# Altium schematic sheet ansari.SCHDOC
size B
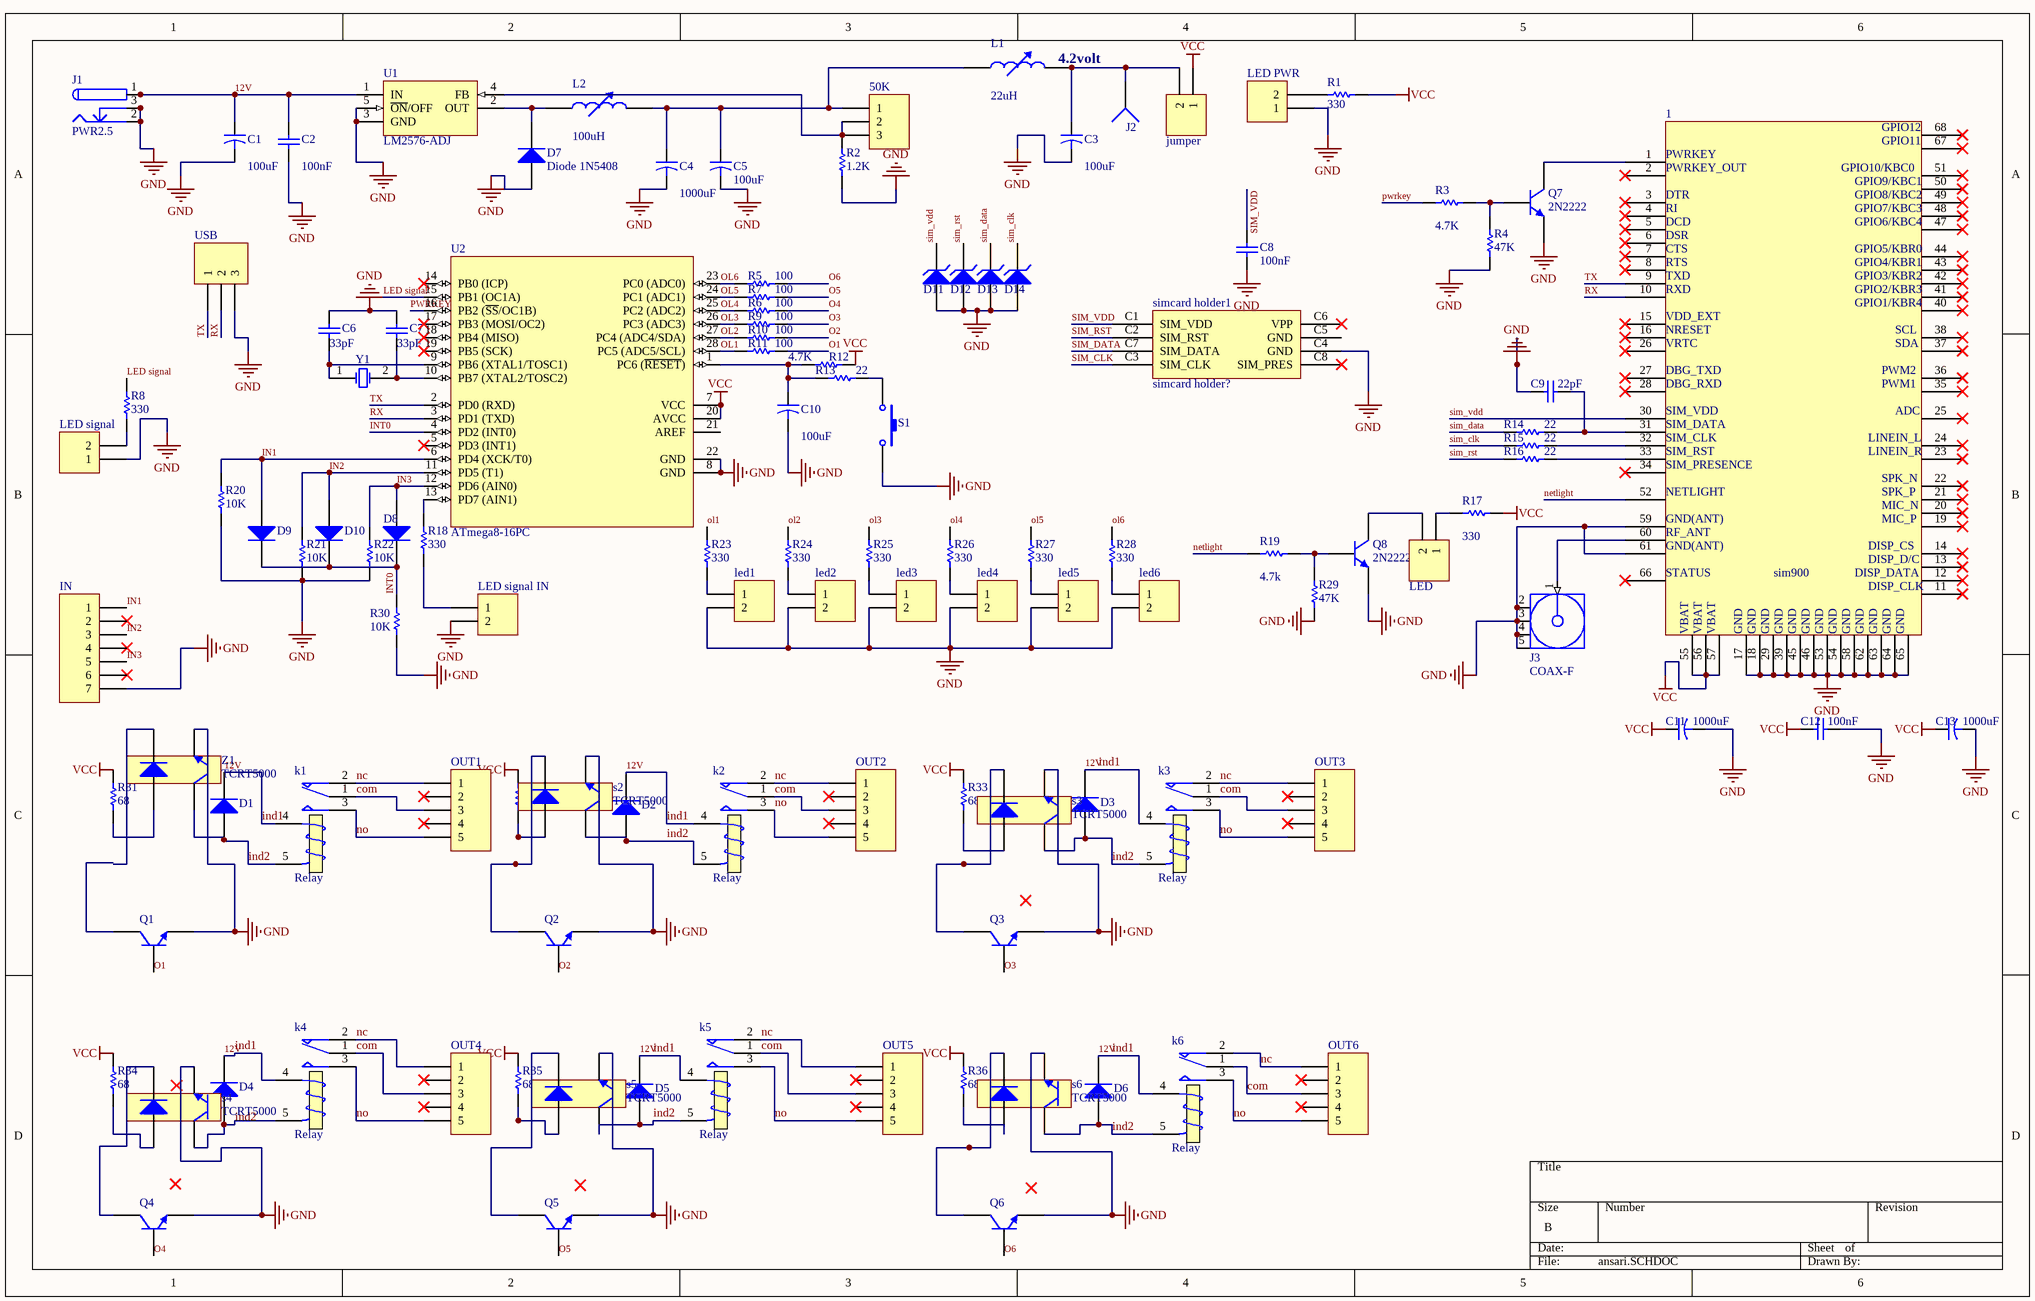
[diagram p0: ansari.SCHDOC]

## Parts
1  sim900  [SIM900]
50K  Header 3  [HDR1X3]  (value not drawn)
C1  value 100uF  [CAPR5-4X5]  (hidden comment: Cap2)
C2  value 100nF  [VP32-3.2]  (hidden comment: Cap)
C3  value 100uF  [CAPR5-4X5]  (hidden comment: Cap2)
C4  value 1000uF  [CAPR5-4X5]  (hidden comment: Cap2)
C5  value 100uF  [CAPR5-4X5]  (hidden comment: Cap2)
C6  value 33pF  [VP32-3.2]  (hidden comment: Cap)
C7  value 33pF  [VP32-3.2]  (hidden comment: Cap)
C8  value 100nF  [VP32-3.2]  (hidden comment: Cap)
C9  value 22pF  [VP32-3.2]  (hidden comment: Cap)
C10  value 100uF  [CAPR5-4X5]  (hidden comment: Cap2)
C11  value 1000uF  [CAPR5-4X5]  (hidden comment: Cap2)
C12  value 100nF  [RAD-0.3]  (hidden comment: Cap)
C13  value 1000uF  [CAPR5-4X5]  (hidden comment: Cap2)
D1  Diode 1N4148  [DO-35]  (value not drawn)
D2  Diode 1N4148  [DO-35]  (value not drawn)
D3  Diode 1N4148  [DO-35]  (value not drawn)
D4  Diode 1N4148  [DO-35]  (value not drawn)
D5  Diode 1N4148  [DO-35]  (value not drawn)
D6  Diode 1N4148  [DO-35]  (value not drawn)
D7  Diode 1N5408  [DO-201AD]
D8  Diode 1N4148  [DO-35]  (value not drawn)
D9  Diode 1N4148  [DO-35]  (value not drawn)
D10  Diode 1N4148  [DO-35]  (value not drawn)
D11  D Zener4v7  [DIODE-0.7]  (value not drawn)
D12  D Zener4v7  [DIODE-0.7]  (value not drawn)
D13  D Zener4v7  [DIODE-0.7]  (value not drawn)
D14  D Zener4v7  [DIODE-0.7]  (value not drawn)
IN  Header 7  [HDR1X7]  (value not drawn)
J1  PWR2.5  [KLD-0202]
J2  Socket  [PIN1]  (value not drawn)
J3  COAX-F  [MCX5.08-H5]
jumper  Header 2  [HDR1X2]  (value not drawn)
k1  Relay  [Relays]
k2  Relay  [Relays]
k3  Relay  [Relays]
k4  Relay  [Relays]
k5  Relay  [Relays]
k6  Relay  [Relays]
L1  value 22uH  [AXIAL-0.8]  (hidden comment: Inductor Adj)
L2  value 100uH  [AXIAL-0.8]  (hidden comment: Inductor Adj)
LED  Header 2  [HDR1X2]  (value not drawn)
led1  Header 2  [HDR1X2]  (value not drawn)
led2  Header 2  [HDR1X2]  (value not drawn)
led3  Header 2  [HDR1X2]  (value not drawn)
led4  Header 2  [HDR1X2]  (value not drawn)
led5  Header 2  [HDR1X2]  (value not drawn)
led6  Header 2  [HDR1X2]  (value not drawn)
LED_PWR  Header 2  [HDR1X2]  (value not drawn)
LED_signal  Header 2  [HDR1X2]  (value not drawn)
LED_signal_IN  Header 2  [HDR1X2]  (value not drawn)
OUT1  Header 5  [HDR1X5]  (value not drawn)
OUT2  Header 5  [HDR1X5]  (value not drawn)
OUT3  Header 5  [HDR1X5]  (value not drawn)
OUT4  Header 5  [HDR1X5]  (value not drawn)
OUT5  Header 5  [HDR1X5]  (value not drawn)
OUT6  Header 5  [HDR1X5]  (value not drawn)
Q1  2N2222  [22-03]  (value not drawn)
Q2  2N2222  [22-03]  (value not drawn)
Q3  2N2222  [22-03]  (value not drawn)
Q4  2N2222  [22-03]  (value not drawn)
Q5  2N2222  [22-03]  (value not drawn)
Q6  2N2222  [22-03]  (value not drawn)
Q7  2N2222  [22-03]
Q8  2N2222  [22-03]
R1  value 330  [AXIAL-0.3]  (hidden comment: Res1)
R2  value 1.2K  [AXIAL-0.3]  (hidden comment: Res1)
R3  value 4.7K  [AXIAL-0.3]  (hidden comment: Res1)
R4  value 47K  [AXIAL-0.3]  (hidden comment: Res1)
R5  value 100  [AXIAL-0.3]  (hidden comment: Res1)
R6  value 100  [AXIAL-0.3]  (hidden comment: Res1)
R7  value 100  [AXIAL-0.3]  (hidden comment: Res1)
R8  value 330  [AXIAL-0.3]  (hidden comment: Res1)
R9  value 100  [AXIAL-0.3]  (hidden comment: Res1)
R10  value 100  [AXIAL-0.3]  (hidden comment: Res1)
R11  value 100  [AXIAL-0.3]  (hidden comment: Res1)
R12  value 4.7K  [AXIAL-0.3]  (hidden comment: Res1)
R13  value 22  [AXIAL-0.3]  (hidden comment: Res1)
R14  value 22  [AXIAL-0.3]  (hidden comment: Res1)
R15  value 22  [AXIAL-0.3]  (hidden comment: Res1)
R16  value 22  [AXIAL-0.3]  (hidden comment: Res1)
R17  value 330  [AXIAL-0.3]  (hidden comment: Res1)
R18  value 330  [AXIAL-0.3]  (hidden comment: Res1)
R19  value 4.7k  [AXIAL-0.3]  (hidden comment: Res1)
R20  value 10K  [AXIAL-0.3]  (hidden comment: Res1)
R21  value 10K  [AXIAL-0.3]  (hidden comment: Res1)
R22  value 10K  [AXIAL-0.3]  (hidden comment: Res1)
R23  value 330  [AXIAL-0.3]  (hidden comment: Res1)
R24  value 330  [AXIAL-0.3]  (hidden comment: Res1)
R25  value 330  [AXIAL-0.3]  (hidden comment: Res1)
R26  value 330  [AXIAL-0.3]  (hidden comment: Res1)
R27  value 330  [AXIAL-0.3]  (hidden comment: Res1)
R28  value 330  [AXIAL-0.3]  (hidden comment: Res1)
R29  value 47K  [AXIAL-0.3]  (hidden comment: Res1)
R30  value 10K  [AXIAL-0.3]  (hidden comment: Res1)
R31  value 68  [AXIAL-0.3]  (hidden comment: Res1)
R32  value 68  [AXIAL-0.3]  (hidden comment: Res1)
R33  value 68  [AXIAL-0.3]  (hidden comment: Res1)
R34  value 68  [AXIAL-0.3]  (hidden comment: Res1)
R35  value 68  [AXIAL-0.3]  (hidden comment: Res1)
R36  value 68  [AXIAL-0.3]  (hidden comment: Res1)
S1  SW-PB  [SPST-2]  (value not drawn)
s2  TCRT5000  [TCRT5000]
s3  TCRT5000  [TCRT5000]
s4  TCRT5000  [TCRT5000]
s5  TCRT5000  [TCRT5000]
s6  TCRT5000  [TCRT5000]
simcard_holder1  simcard holder?  [Sim Card]
U1  LM2576-ADJ  [T05A]
U2  ATmega8-16PC  [28P3]
USB  Header 3  [HDR1X3]  (value not drawn)
Y1  XTAL  [R38]  (value not drawn)
Z1  TCRT5000  [TCRT5000]

## Nets
GND: 1.17 1.18 1.29 1.39 1.45 1.46 1.53 1.54 1.58 1.59 1.61 1.62 1.63 1.64 1.65 C1.2 C2.1 C3.2 C4.2 C5.2 C6.2 C7.2 C8.2 C9.2 C10.2 C11.2 C12.2 C13.2 D7.1(A) D11.1(A) D12.1(A) D13.1(A) D14.1(A) IN.7 J1.2 J1.2A J1.2B J1.3 J1.3A J1.3B J3.2(GND) J3.3(GND) J3.4(GND) J3.5(GND) led1.2 led2.2 led3.2 led4.2 led5.2 led6.2 LED_PWR.1 LED_signal.1 LED_signal_IN.2 Q1.1(E) Q2.1(E) Q3.1(E) Q4.1(E) Q5.1(E) Q6.1(E) Q7.1(E) Q8.1(E) R2.1 R4.1 R20.1 R21.1 R22.1 R29.1 R30.1 S1.2 s2.E s3.E s4.E s5.E s6.E simcard_holder1.C4(GND) U1.3(GND) U1.5(~{ON}/OFF) U2.8(GND) U2.22(GND) USB.3 Z1.E
VCC: 1.55 1.56 1.57 C11.1 C12.1 C13.1 jumper.1 R1.1 R12.2 R17.2 R31.2 R32.2 R33.2 R34.2 R35.2 R36.2 U2.7(VCC) U2.20(AVCC)
12V: C1.1 C2.2 D1.2(K) D2.2(K) D3.2(K) D4.2(K) D5.2(K) D6.2(K) J1.1 J1.1A J1.1B k1.4(T1) k2.4(T1) k3.4(T1) k4.4(T1) k5.4(T1) k6.4(T1) U1.1(IN)  [also labelled ind1]
com: k1.1(COM) k2.1(COM) k3.1(COM) k4.1(COM) k5.1(COM) k6.1(COM) OUT1.3 OUT2.3 OUT3.3 OUT4.3 OUT5.3 OUT6.3
IN1: D9.1(A) IN.1 R20.2 U2.6(PD4_(XCK/T0))
IN2: D10.1(A) IN.3 R21.2 U2.11(PD5_(T1))
IN3: D8.1(A) IN.5 R22.2 U2.12(PD6_(AIN0))
ind2: D1.1(A) D2.1(A) D3.1(A) D4.1(A) D5.1(A) D6.1(A) k1.5(T2) k2.5(T2) k3.5(T2) k4.5(T2) k5.5(T2) k6.5(T2) s2.C s3.C s4.C s5.C s6.C Z1.C
INT0: D8.2(K) D9.2(K) D10.2(K) R30.2 U2.4(PD2_(INT0))
LED signal: R8.2 U2.15(PB1_(OC1A))
nc: k1.2(NC) k2.2(NC) k3.2(NC) k4.2(NC) k5.2(NC) k6.2(NC) OUT1.1 OUT2.1 OUT3.1 OUT4.1 OUT5.1 OUT6.1
netlight: 1.52 R19.1
no: k1.3(NO) k2.3(NO) k3.3(NO) k4.3(NO) k5.3(NO) k6.3(NO) OUT1.5 OUT2.5 OUT3.5 OUT4.5 OUT5.5 OUT6.5
O1: Q1.2(B) R11.2
O2: Q2.2(B) R10.2
O3: Q3.2(B) R9.2
O4: Q4.2(B) R6.2
O5: Q5.2(B) R7.2
O6: Q6.2(B) R5.2
OL1: R11.1 R23.2 U2.28(PC5_(ADC5/SCL))
OL2: R10.1 R24.2 U2.27(PC4_(ADC4/SDA))
OL3: R9.1 R25.2 U2.26(PC3_(ADC3))
OL4: R6.1 R26.2 U2.25(PC2_(ADC2))
OL5: R7.1 R27.2 U2.24(PC1_(ADC1))
OL6: R5.1 R28.2 U2.23(PC0_(ADC0))
PWRKEY: R3.1 U2.16(PB2_(~{SS}/OC1B))
RX: 1.10 U2.3(PD1_(TXD)) USB.2
sim_clk: D14.2(K) R15.1 simcard_holder1.C3(SIM_CLK)
sim_data: D13.2(K) R14.1 simcard_holder1.C7(SIM_DATA)
sim_rst: D12.2(K) R16.1 simcard_holder1.C2(SIM_RST)
sim_vdd: 1.30 C8.1 D11.2(K) simcard_holder1.C1(SIM_VDD)
TX: 1.9 U2.2(PD0_(RXD)) USB.1
Net1_1: 1.1 Q7.3(C)
Net1_31: 1.31 C9.1 R14.2
Net1_32: 1.32 R15.2
Net1_33: 1.33 R16.2
Net1_60: 1.60 J3.1(Signal)
Net50K_1: 50K.1 C4.1 C5.1 L1.1 L2.2
Net50K_2: 50K.2 50K.3 R2.2 U1.4(FB)
NetC3_1: C3.1 J2.1 jumper.2 L1.2
NetC6_1: C6.1 U2.9(PB6_(XTAL1/TOSC1)) Y1.1(OSC1)
NetC7_1: C7.1 U2.10(PB7_(XTAL2/TOSC2)) Y1.2(OSC2)
NetC10_1: C10.1 R12.1 R13.1 U2.1(PC6_(~{RESET}))
NetD7_2: D7.2(K) L2.1 U1.2(OUT)
Netled1_1: led1.1 R23.1
Netled2_1: led2.1 R24.1
Netled3_1: led3.1 R25.1
Netled4_1: led4.1 R26.1
Netled5_1: led5.1 R27.1
Netled6_1: led6.1 R28.1
NetLED_1: LED.1 R17.1
NetLED_2: LED.2 Q8.3(C)
NetLED_PWR_2: LED_PWR.2 R1.2
NetLED_signal_2: LED_signal.2 R8.1
NetLED_signal_IN_1: LED_signal_IN.1 R18.1
NetQ2_3: Q2.3(C) s2.K
NetQ3_3: Q3.3(C) s3.K
NetQ4_3: Q4.3(C) s4.K
NetQ5_3: Q5.3(C) s5.K
NetQ6_3: Q6.3(C) s6.K
NetQ7_2: Q7.2(B) R3.2 R4.2
NetQ8_2: Q8.2(B) R19.2 R29.2
NetR13_2: R13.2 S1.1
NetR18_2: R18.2 U2.13(PD7_(AIN1))
NetR31_1: R31.1 Z1.A
NetR32_1: R32.1 s2.A
NetR33_1: R33.1 s3.A
NetR34_1: R34.1 s4.A
NetR35_1: R35.1 s5.A
NetR36_1: R36.1 s6.A

Not connected (* = marked no-connect by the designer): 1 2* 3* 4* 5* 6* 7* 8* 11* 12* 13* 14* 15* 16* 19* 20* 21* 22* 23* 24* 25* 26* 27* 28* 34* 35* 36* 37* 38* 40* 41* 42* 43* 44* 47* 48* 49* 50* 51* 66* 67* 68*; IN 2* 4* 6*; OUT1 2* 4*; OUT2 2* 4*; OUT3 2* 4*; OUT4 2* 4*; OUT5 2* 4*; OUT6 2* 4*; Q1 3(C); simcard_holder1 C5(GND) C6(VPP)* C8(SIM_PRES)*; U2 5(PD3_(INT1))* 14(PB0_(ICP))* 17(PB3_(MOSI/OC2))* 18(PB4_(MISO))* 19(PB5_(SCK))* 21(AREF); Z1 K

## Notes on the sheet
- (near L1) 4.2volt
- (in symbol sim900) GPIO12; GPIO11; PWRKEY; PWRKEY_OUT; GPIO10/KBC0; GPIO9/KBC1; DTR; GPIO8/KBC2; RI; GPIO7/KBC3; DCD; GPIO6/KBC4; DSR; CTS; GPIO5/KBR0; RTS; GPIO4/KBR1; TXD; GPIO3/KBR2; RXD; GPIO2/KBR3; GPIO1/KBR4; VDD_EXT; NRESET; SCL; VRTC; SDA; DBG_TXD; PWM2; DBG_RXD; PWM1; SIM_VDD; ADC; SIM_DATA; SIM_CLK; LINEIN_L; SIM_RST; LINEIN_R; SIM_PRESENCE; SPK_N; NETLIGHT; SPK_P; MIC_N; GND(ANT); MIC_P; RF_ANT; DISP_CS; DISP_D/C; STATUS; DISP_DATA; DISP_CLK; VBAT; GND

## Library data of the parts
50K USB = Header 3: Header, 3-Pin; LatestRevisionDate: 17-Jul-2002; LatestRevisionNote: Re-released for DXP Platform.; Publisher: Altium Limited
C1 C3-C5 C10 C11 C13 = Cap2: Capacitor; Published: 23-Sep-2002; PackageReference: CAPR5-4X5; Publisher: Altium Limited
C2 C6-C9 C12 = Cap: Capacitor; Published: 8-Jun-2000; LatestRevisionDate: 17-Jul-2002; LatestRevisionNote: Re-released for DXP Platform.; PackageReference: RAD-0.3; Publisher: Altium Limited
D1-D6 D8-D10 = Diode 1N4148: High Conductance Fast Diode; Published: 8-Jun-2000; LatestRevisionDate: 17-Jul-2002; LatestRevisionNote: Re-released for DXP Platform.; DatasheetDocument: 1997; PackageReference: DO-35; Publisher: Altium Limited; Code_JEDEC: DO-204-AH; ComponentLink1Description: Manufacturer Link; ComponentLink1URL: http://www.fairchildsemi.com/; ComponentLink2Description: Datasheet; ComponentLink2URL: http://www.fairchildsemi.com/ds/1N%2F1N4148.pdf
D7 = Diode 1N5408: 3 Amp Medium Power Silicon Rectifier Diode; Published: 8-Jun-2000; LatestRevisionDate: 17-Jul-2002; LatestRevisionNote: Re-released for DXP Platform.; DatasheetDocument: Aug-1984; PackageReference: DO-201AD; Publisher: Altium Limited; ComponentLink1Description: Manufacturer Link; ComponentLink1URL: http://www.irf.com/
D11-D14 = D Zener: Zener Diode; Published: 8-Jun-2000; LatestRevisionDate: 17-Jul-2002; LatestRevisionNote: Re-released for DXP Platform.; PackageReference: DIODE-0.7; Publisher: Altium Limited
IN = Header 7: Header, 7-Pin; LatestRevisionDate: 17-Jul-2002; LatestRevisionNote: Re-released for DXP Platform.; Publisher: Altium Limited
J1 = PWR2.5: Low Voltage Power Supply Connector; Published: 17-Dec-2003; DatasheetDocument: 09-May-2002; Publisher: Altium Limited; ComponentLink1Description: Manufacturer Link; ComponentLink1URL: http://domino.kycon.com/internet/Products.html
J3 = COAX-F: RF Coaxial PCB Connector, MCX; Thru-Hole, Right-Angle Mount Socket, Blunt Post Terminal, 50 Ohm Impedance; PCB_Layout: Complies with manufacturer's recommendation.; DrillSize: Corresponds to nominal value.; Published: 15-Jul-2004; LatestRevisionDate: 15-Jul-2004; LatestRevisionNote: Component Replaced.; DatasheetDocument: 30-May-2003; PackageDocument: 04-Jul-1999; PackageReference: 919-119J-51AX; Publisher: Altium Limited; ComponentLink1Description: Manufacturer Link; ComponentLink1URL: http://www.amphenolrf.com/
jumper LED led1-led6 LED_PWR LED_signal LED_signal_IN = Header 2: Header, 2-Pin; LatestRevisionDate: 17-Jul-2002; LatestRevisionNote: Re-released for DXP Platform.; Publisher: Altium Limited
k1-k6 = Relay: SPDT Relay; Published: 8-Jun-2000; LatestRevisionDate: 17-Jul-2002; LatestRevisionNote: Re-released for DXP Platform.; PackageReference: MODULE5B; Publisher: Altium Limited
L1 L2 = Inductor Adj: Adjustable Inductor; Set Position: 0.5; Published: 24-Mar-1999; LatestRevisionDate: 17-Jul-2002; LatestRevisionNote: Re-released for DXP Platform.; PackageReference: AXIAL-0.8; Publisher: Altium Limited
OUT1-OUT6 = Header 5: Header, 5-Pin; LatestRevisionDate: 17-Jul-2002; LatestRevisionNote: Re-released for DXP Platform.; Publisher: Altium Limited
Q1-Q8 = 2N2222: General Purpose Transistor NPN Silicon; Published: 29-Sep-2000; LatestRevisionDate: 17-Jul-2002; LatestRevisionNote: Re-released for DXP Platform.; DatasheetVersion: 1991; PackageVersion: 1997; PackageReference: 22-03; Publisher: Altium Limited; PackageDescription: Can; 3 Leads; Pin Circle Dia. 2.54 mm; Lead Dia. 0.48 mm (max); ComponentLink1Description: Manufacturer Link; ComponentLink1URL: http://www.onsemi.com/site/products/landing?taxonomyID=194
R1-R36 = Res1: Resistor; Published: 8-Jun-2000; LatestRevisionDate: 17-Jul-2002; LatestRevisionNote: Re-released for DXP Platform.; PackageReference: AXIAL-0.3; Publisher: Altium Limited
S1 = SW-PB: Switch; Published: 24-Mar-1999; LatestRevisionDate: 17-Jul-2002; LatestRevisionNote: Re-released for DXP Platform.; PackageReference: SPST-2; Publisher: Altium Limited
s2-s6 Z1 = TCRT5000: IR LED; T&R; Designer: Seyed Mohsen Ghasemain; ComponentLinkURL: www.picpars.com
simcard_holder1 = simcard holder
U1 = LM2576HVT-5.0: Simple Switcher 3A Step Down Voltage Regulator; Note: Tab is connected to GND; Published: 15-Apr-2002; DatasheetVersion: Jun-1999; PackageVersion: 2000; PackageReference: T05A; Publisher: Altium Limited; PackageDescription: TO, Thru-Hole, Vertical, Heatsink Mounted; 5 In-Line Leads; Pitch 1.70 mm; Code_JEDEC: TS-001-AA; ComponentLink1Description: Manufacturer Link; ComponentLink1URL: http://www.national.com/; ComponentLink2Description: Datasheet; ComponentLink2URL: http://www.national.com/ds.cgi/LM/LM2576.pdf; ComponentLink3Description: URL Link1; ComponentLink3URL: http://www.national.com/pf/LM/LM2576HV.html
U2 = ATmega8-16PC: 8-Bit AVR Microcontroller with 8K Bytes of In-System Programmable Flash Memory; Published: 17-Sep-2003; LatestRevisionDate: 04-Mar-2005; LatestRevisionNote: Stylized 3D Model Added.; DatasheetVersion: 2486H-AVR-09/02; PackageVersion: revB, Sep-2001; PackageReference: 28P3; Publisher: Altium Limited; PackageDescription: DIP; 28 Leads; Row Spacing 7.62 mm; Pitch 2.54 mm; ComponentLink1Description: Manufacturer Link; ComponentLink1URL: http://www.atmel.com; ComponentLink2Description: Datasheet; ComponentLink2URL: http://www.atmel.com/dyn/resources/prod_documents/doc2486.pdf
Y1 = XTAL: Crystal Oscillator; Published: 8-Jun-2000; LatestRevisionDate: 17-Jul-2002; LatestRevisionNote: Re-released for DXP Platform.; PackageReference: R38; Publisher: Altium Limited
J2 = Socket: LatestRevisionDate: 17-Jul-2002; LatestRevisionNote: Re-released for DXP Platform.; Publisher: Altium Limited